# EAGLE design Micro-Interactions (EAGLE 9.6.2)
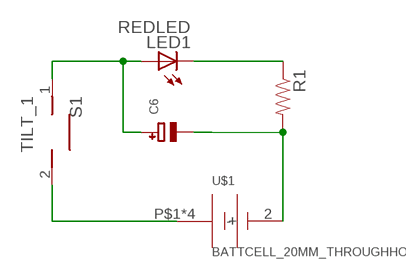
[diagram p0: schematic, sheet 1]

## Parts
C6  CAP_ELECTROLYTICPTH_3.5MMGRID_8MMDIA  [CELEC_3.5MM_8MM]
LED1  REDLED  LED5MM  [LED5MM]
R1  RESISTORAXIAL-0.3  [AXIAL-0.3]
S1  TILT_1  DS01  [DS-01]
U$1  BATTCELL_20MM_THROUGHHOLE  [BATTCON_20MM_4LEGS]

## Nets
N$2: C6.+ LED1.A S1.1
N$3: LED1.K(C) R1.P$1
N$4: S1.2 U$1.P$1(+) U$1.P$2(+) U$1.P$3(+) U$1.P$4(+)
N$6: C6.- R1.P$2 U$1.2(-)

## Library data of the parts
C6 = UG_2832HSWEG02:CAP_ELECTROLYTIC: Electrolytic Capacitors SMT PANASONIC_C - Size C Panasonic Electrolytic Aluminum Capacitor 47µF 16V 20% Electrolytic Capacitor [Digikey: PCE3890TR-ND] PANASONIC_D - Size D Panasonic Electrolytic Aluminum Capacitor 100µF 25V 20% Electrolytic Capacitor [Digikey: PCE3898TR-ND] PTH 3.5 mm grid, 8 mm diameter ... 3.5 mm grid, 10 mm diameter ...
LED1 = SparkFun-LED:LED: LEDs Standard schematic elements and footprints for 5mm, 3mm, 1206, and 0603 sized LEDs. 5mm - Spark Fun Electronics SKU : COM-00529 (and others)
R1 = SparkFun-Passives:RESISTOR: Resistor Basic schematic elements and footprints for 0603, 1206, and PTH resistors.
S1 = switch-dil:DS01: DIL/CODE SWITCH; OC_FARNELL: unknown; OC_NEWARK: unknown
U$1 = 20mm_cell_throughholl:BATTCELL_20MM_THROUGHHOLE

## Board
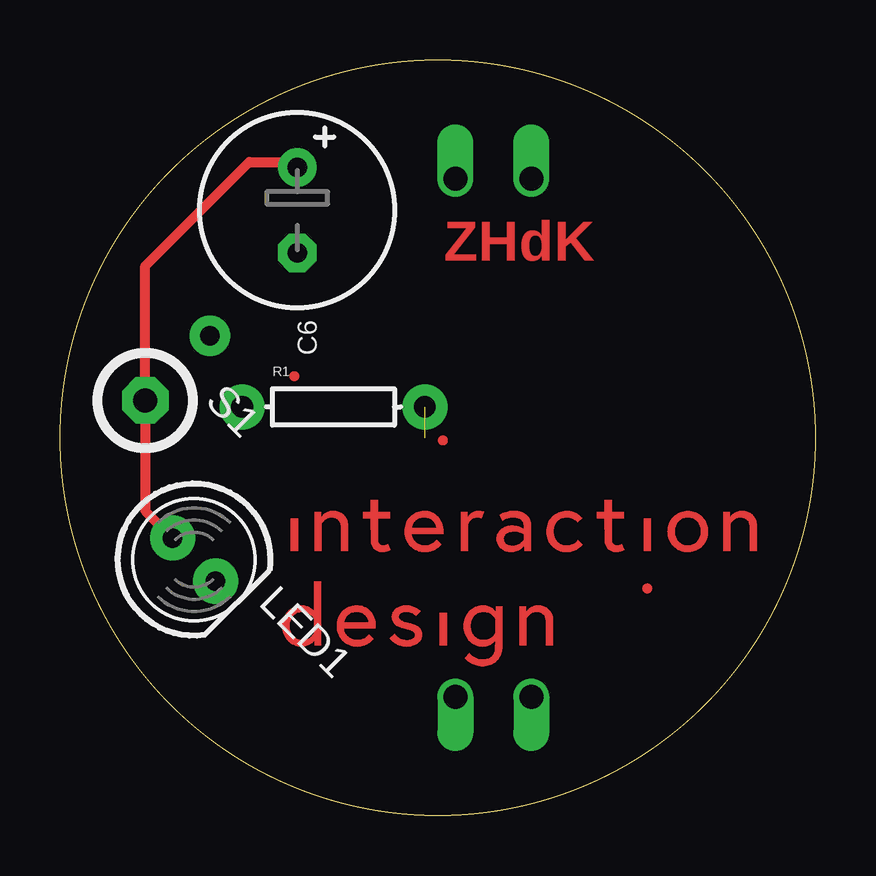
[diagram p1: board, top side]
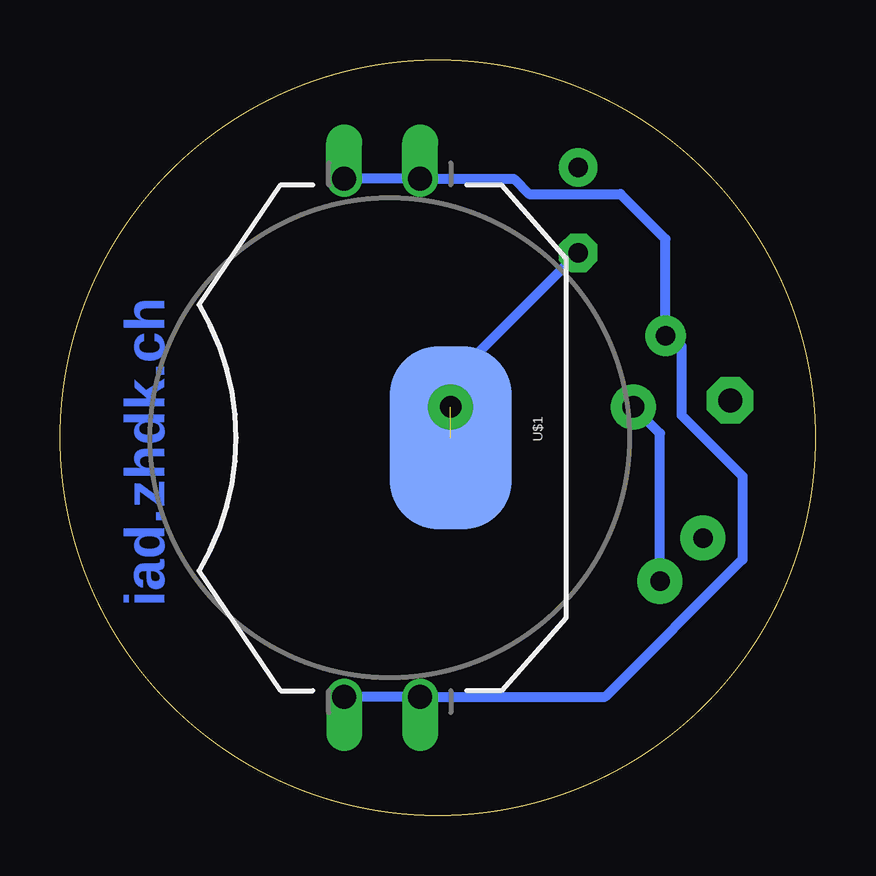
[diagram p2: board, bottom side, seen from below]

Size 31.5 x 31.5 mm. Coordinates in mm from the lower left corner, seen from the top.
Outline: circle at 15.75,15.75 radius 15.75
Copper layers (1*16): Top 0.035mm / dielectric 1.5mm / Bottom 0.035mm
Design rules "SparkFun-2-layer-STANDARD": minimum track width 10mil, minimum drill 20mil, track to track 10mil, track to pad 8mil, pad to pad 8mil, via to via 10mil, smd to smd 8mil, copper to edge 8mil, drill to drill 8mil, minimum pad ring 10mil, minimum via ring 10mil, stop-mask expansion 4mil, vias tented up to drill 25mil, thermal gap 10mil

### Footprints (pad centres in the part's own frame; a part is rotated, then mirrored left to right if it is on the bottom)
CELEC_3.5MM_8MM = drill 0.813 pad 1.6: + -1.778,0 | drill 0.813 pad 1.6 octagon: - 1.778,0
LED5MM = drill 0.813 pad 1.88: A -1.27,0; K 1.27,0
AXIAL-0.3 = drill 0.9 pad 1.88: P$1 -3.81,0; P$2 3.81,0
DS-01 = drill 1 pad 1.93 octagon: 1 0,0 | drill 0.813 pad 1.676: 2 0,3.81
BATTCON_20MM_4LEGS = smd 7.62 x 5.08: 2 0,2.54 | drill 1 offset: P$1 -10.795,1.27; P$2 -10.795,-1.905; P$3 10.795,1.27; P$4 10.795,-1.905

### Placement (x,y rotation side)
C6  9.89,25.24 270 top
LED1  5.59,10.67 315 top
R1  11.4,17.04 0 top
S1  3.56,17.31 315 top
U$1  17.75,15.75 270 bottom
U$2  [IADLOGO_20MM]  7.37,5.46 0 top

### Tracks (layer width: path | path; a pad name or v marks a point on that pad's centre or on a via)
N$2
  Top 0.406: LED1.A 3.56,12.7 S1.1 3.56,22.91 7.89,27.24 9.67,27.24 C6.+
N$3
  Bottom 0.406: LED1.K 6.49,15.93 R1.P$1
N$4
  Bottom 0.406: U$1.P$2 U$1.P$1 12.57,26.54 11.94,25.91 8.13,25.91 6.25,24.03 S1.2 6.25,20.22 5.59,19.56 5.59,16.69 3.05,14.15 3.05,10.67 8.77,4.95 U$1.P$3 U$1.P$4
N$6  (1 unrouted)
  Bottom 0.406: C6.- 14.89,18.46 14.89,17.24 15.21,16.92 U$1.2

### Text on the board
Top: ZHdK
Bottom: iad.zhdk.ch
bStop: iad.zhdk.ch
tSilk: CAP | RESISTOR | SWITCH | LED